# EAGLE schematic tape_follower (EAGLE 8.6.3)
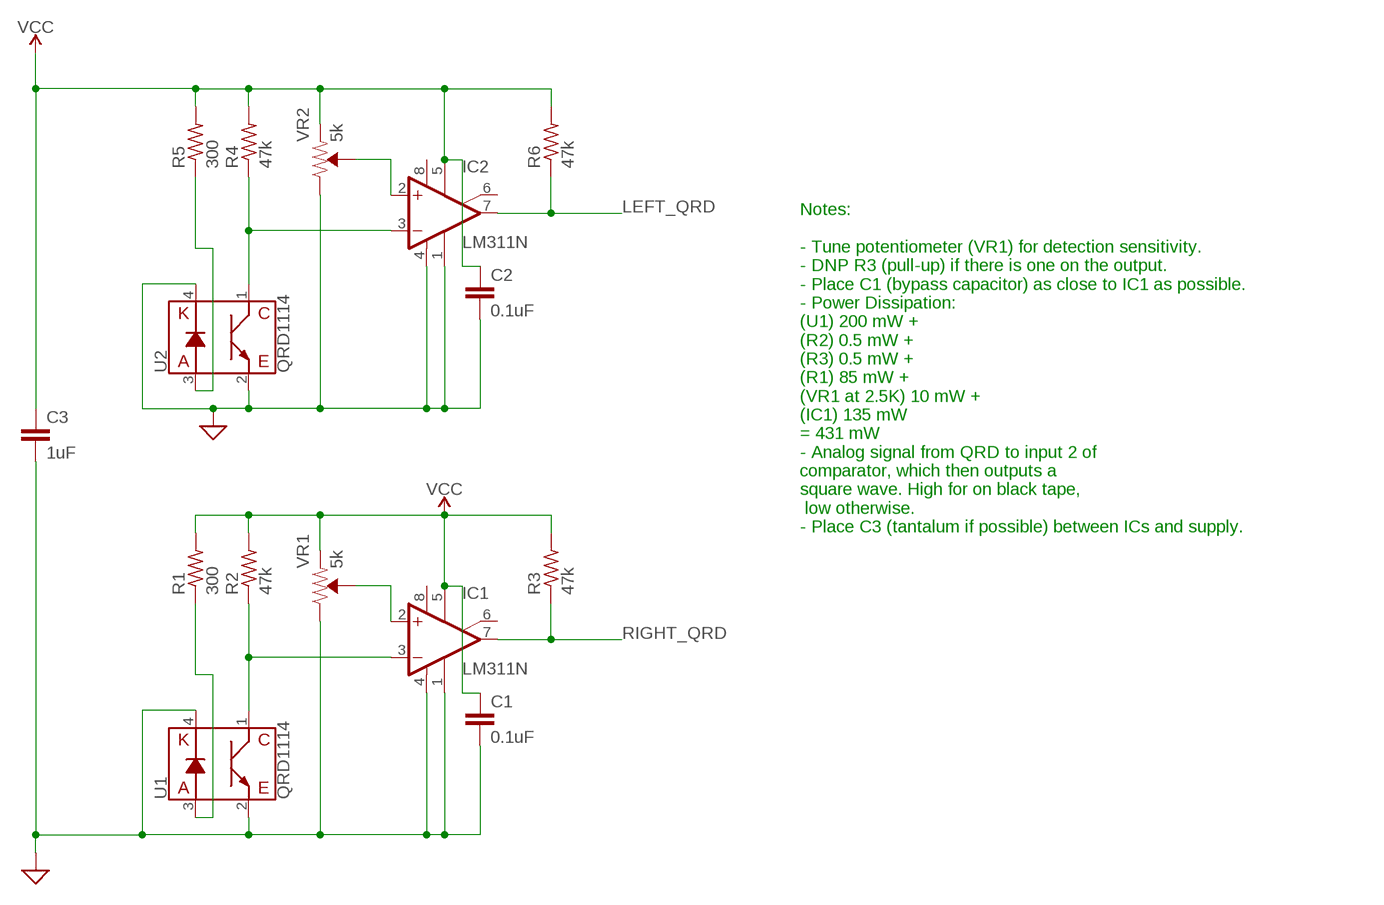
[diagram p0: schematic, sheet 1]

## Parts
C1  0.1uF  0.1UF-KIT-EZ-50V-20%  [CAP-PTH-SMALL-KIT]
C2  0.1uF  0.1UF-KIT-EZ-50V-20%  [CAP-PTH-SMALL-KIT]
C3  1uF  0.1UF-KIT-EZ-50V-20%  [CAP-PTH-SMALL-KIT]
IC1  LM311N  [DIL08]
IC2  LM311N  [DIL08]
R1  300  R-US_0204/5  [0204/5]
R2  47k  R-US_0204/5  [0204/5]
R3  47k  R-US_0204/5  [0204/5]
R4  47k  R-US_0204/5  [0204/5]
R5  300  R-US_0204/5  [0204/5]
R6  47k  R-US_0204/5  [0204/5]
U1  QRD1114  [QRD1114]
U2  QRD1114  [QRD1114]
VR1  5k  TRIMPOT-SMD-5MM-CLOSED-1/4W-20%  [TRIMPOT-SMD-5MM]
VR2  5k  TRIMPOT-SMD-5MM-CLOSED-1/4W-20%  [TRIMPOT-SMD-5MM]

## Nets
GND: C1.2 C2.2 C3.2 IC1.1(GND) IC1.4(V-) IC2.1(GND) IC2.4(V-) U1.2(E) U1.4(K) U2.2(E) U2.4(K) VR1.C(CW) VR2.C(CW) ; supply symbol labelled SUP
LEFT_QRD: IC2.7(OUT) R6.1
N$1: IC1.2(+IN) VR1.B(WIPER)
N$2: R1.1 U1.3(A)
N$3: IC1.3(-IN) R2.1 U1.1(C)
N$4: R5.1 U2.3(A)
N$5: IC2.3(-IN) R4.1 U2.1(C)
N$6: IC2.2(+IN) VR2.B(WIPER)
RIGHT_QRD: IC1.7(OUT) R3.1
VCC: C1.1 C2.1 C3.1 IC1.5(ON) IC2.5(ON) R1.2 R2.2 R3.2 R4.2 R5.2 R6.2 VR1.A(CCW) VR2.A(CCW)
Unconnected: IC1.6(ON/STR) IC2.6(ON/STR)

## Notes on the sheet
- Notes:
  
  - Tune potentiometer (VR1) for detection sensitivity.
  - DNP R3 (pull-up) if there is one on the output.
  - Place C1 (bypass capacitor) as close to IC1 as possible.
  - Power Dissipation: 
  (U1) 200 mW + 
  (R2) 0.5 mW + 
  (R3) 0.5 mW + 
  (R1) 85 mW + 
  (VR1 at 2.5K) 10 mW + 
  (IC1) 135 mW
  = 431 mW
  - Analog signal from QRD to input 2 of
  comparator, which then outputs a 
  square wave. High for on black tape,
   low otherwise.
  - Place C3 (tantalum if possible) between ICs and supply.

## Power pins joined to a net without a drawn wire
V+: IC1.8(V+) IC2.8(V+)

## Library data of the parts
C1 C2 = SparkFun-Capacitors:0.1UF: 0.1µF ceramic capacitors A capacitor is a passive two-terminal electrical component used to store electrical energy temporarily in an electric field.; PROD_ID: CAP-08370
C3 = SparkFun-Capacitors:0.1UF: 0.1µF ceramic capacitors A capacitor is a passive two-terminal electrical component used to store electrical energy temporarily in an electric field.; PROD_ID: CAP-08370; VALUE: 0.1uF
IC1 IC2 = linear:LM311: COMPARATOR
R1-R6 = rcl:R-US_: RESISTOR, American symbol; SPICEPREFIX: R
U1 U2 = SparkFun-Sensors:QRD1114: QRD1114 Reflective Proximity, Object Sensor This sensor uses an infrared emitted diode combined with an infrared phototransistor to detect the reflected infrared signal. Ideal for sensing black-to-white transitions or can be used to detect nearby objects (.5-1cm). Datasheet <http://www.sparkfun.com/datasheets/BOT/QRD1114.pdf> SparkFun Products Optical Detector / Phototransistor - QRD1114 <https://www.sparkfun.com/products/246> (SEN-00246); PROD_ID: IC-09032; SF_ID: SEN-00246
VR1 VR2 = SparkFun-Resistors:TRIMPOT: Trimming Potentiometer (Trimpot) Three-terminal potentiometers, with an adjustable wiper and two adjustable resistors. A pot can be used to create a configurable voltage divider, or as a variable resistor. "Trimpots" are a subset of potentiometers, usually intended for "set-and-forget" applications. They're often more delicate than standard potentiometers - rated for fewer turns. Variants PTH-KNOB - PTH Trimpot w/ finger-adjustable knob Trimpot 10K with Knob <https://www.sparkfun.com/products/9806> (COM-09806) Datasheet <http://www.sparkfun.com/datasheets/Components/General/TSR-3386.pdf> SMD-3MM-CLOSED-FRAME - SMD 3mm Square Closed-Frame Trimpot Used on e.g. EasyDriver - Stepper Motor Driver <https://www.sparkfun.com/products/12779> Datasheet <http://www.bitechnologies.com/pdfs/22.pdf> (22AR10KTR) SMD-5MM - SMD 5mm Square Closed-Frame Trimpot Used on e.g. IOIO-OTG - V2.2 <https://www.sparkfun.com/products/13613> Datasheet <http://www.vishay.com/docs/51008/ts53.pdf> (TS53YL502MR10) SMD-3MM-1/10W-25% - 3mm Square Open-Frame Trimpot Used on e.g. SparkFun Shapeoko <https://www.sparkfun.com/products/13899> Datasheet <http://www.bourns.com/docs/Product-Datasheets/TC33.pdf> (TC33X-2-103E); PROD_ID: RES-11156